# Altium schematic sheet LI-ION-Battery.SchDoc
size A4
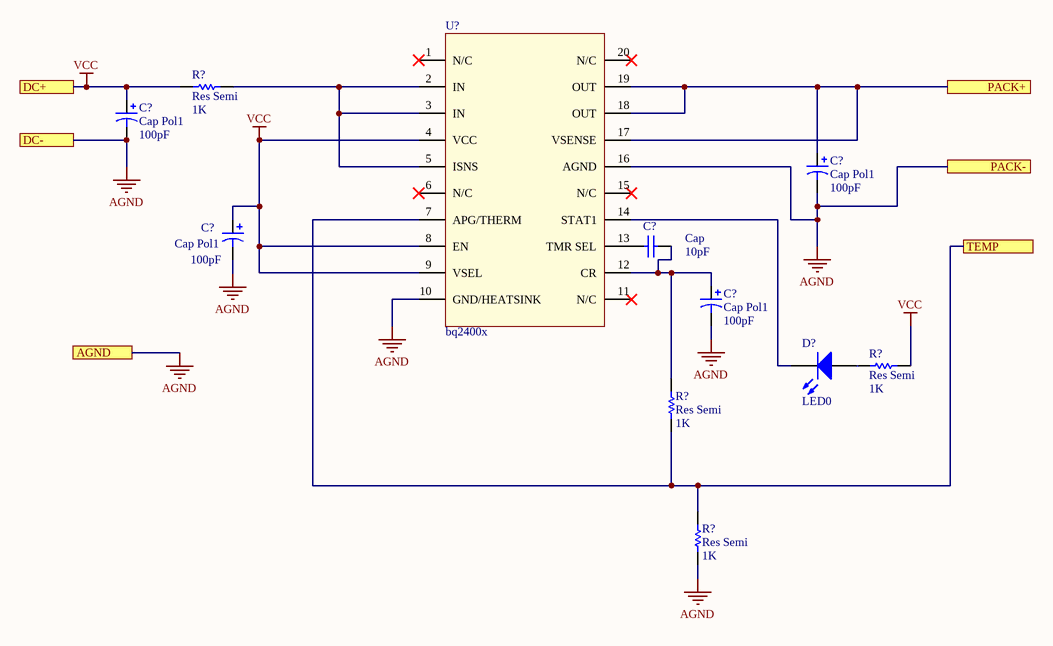
[diagram p0: LI-ION-Battery.SchDoc]

## Parts
(Parts that share a designator on the sheet are numbered #1, #2 ... from top to bottom, then left to right.)
C?#1  Cap Pol1  value 100pF  [RB7.6-15]
C?#2  Cap Pol1  value 100pF  [RB7.6-15]
C?#3  Cap Pol1  value 100pF  [RB7.6-15]
C?#4  Cap  value 10pF  [RAD-0.3]
C?#5  Cap Pol1  value 100pF  [RB7.6-15]
D?  LED0  [LED-0]
R?#1  Res Semi  value 1K  [AXIAL-0.5]
R?#2  Res Semi  value 1K  [AXIAL-0.5]
R?#3  Res Semi  value 1K  [AXIAL-0.5]
R?#4  Res Semi  value 1K  [AXIAL-0.5]
U?  bq2400x

## Ports
AGND, DC+, DC-, PACK+, PACK-, TEMP

## Nets
AGND: C?#1.2 C?#2.2 C?#3.2 C?#5.2 R?#4.1 U?.10(GND/HEATSINK) U?.16(AGND) ; port DC-, port PACK-, port AGND
VCC: C?#1.1 C?#3.1 R?#1.1 R?#2.1 U?.4(VCC) U?.8(EN) U?.9(VSEL) ; port DC+
PACK+: C?#2.1 U?.17(VSENSE) U?.18(OUT) U?.19(OUT) ; port PACK+
TEMP: R?#3.1 R?#4.2 U?.7(APG/THERM) ; port TEMP
NetC?#4_2: C?#4.2 C?#5.1 R?#3.2 U?.12(CR)
NetD?_1: D?.1(A) R?#2.2
NetD?_2: D?.2(K) U?.14(STAT1)
NetR?#1_2: R?#1.2 U?.2(IN) U?.3(IN) U?.5(ISNS)

Not connected (* = marked no-connect by the designer): C?#4 1; U? 1(N/C)* 6(N/C)* 11(N/C)* 13(TMR_SEL) 15(N/C)* 20(N/C)*

## Library data of the parts
C?#1-C?#3 C?#5 = Cap Pol1: Polarized Capacitor (Radial); Published: 8-Jun-2000; LatestRevisionDate: 17-Jul-2002; LatestRevisionNote: Re-released for DXP Platform.; PackageReference: RB7.6-15; Publisher: Altium Limited; PackageDescription: Polarized Capacitor (Radial); 2 Leads
C?#4 = Cap: Capacitor; Published: 8-Jun-2000; LatestRevisionDate: 17-Jul-2002; LatestRevisionNote: Re-released for DXP Platform.; PackageReference: RAD-0.3; Publisher: Altium Limited; PackageDescription: Radial Cap, Thru-Hole; 2 Leads; 0.3 in Pin Spacing
D? = LED0: Typical INFRARED GaAs LED; Published: 8-Jun-2000; LatestRevisionDate: 08-Jul-2005; LatestRevisionNote: Mech Layer 1 removed.; PackageReference: LED-0; Publisher: Altium Limited; PackageDescription: LED; 2 Leads
R?#1-R?#4 = Res Semi: Semiconductor Resistor; Published: 8-Jun-2000; LatestRevisionDate: 17-Jul-2002; LatestRevisionNote: Re-released for DXP Platform.; PackageReference: AXIAL-0.5; Publisher: Altium Limited; PackageDescription: Axial Device, Thru-Hole; 2 Leads; 0.5 in Pin Spacing
U? = bq2400x: Charger Battery Driver